# EasyEDA schematic SCH_QR Code Scanning Kiosk PCB V3 MKR_2022-02-02.json
TITLE: QR Code Scanning Kiosk; REV: 3.0; Date: 2021-10-15; Sheet: 1/1; Drawn By: Steve Julian; Company: BizKiwi.NZ
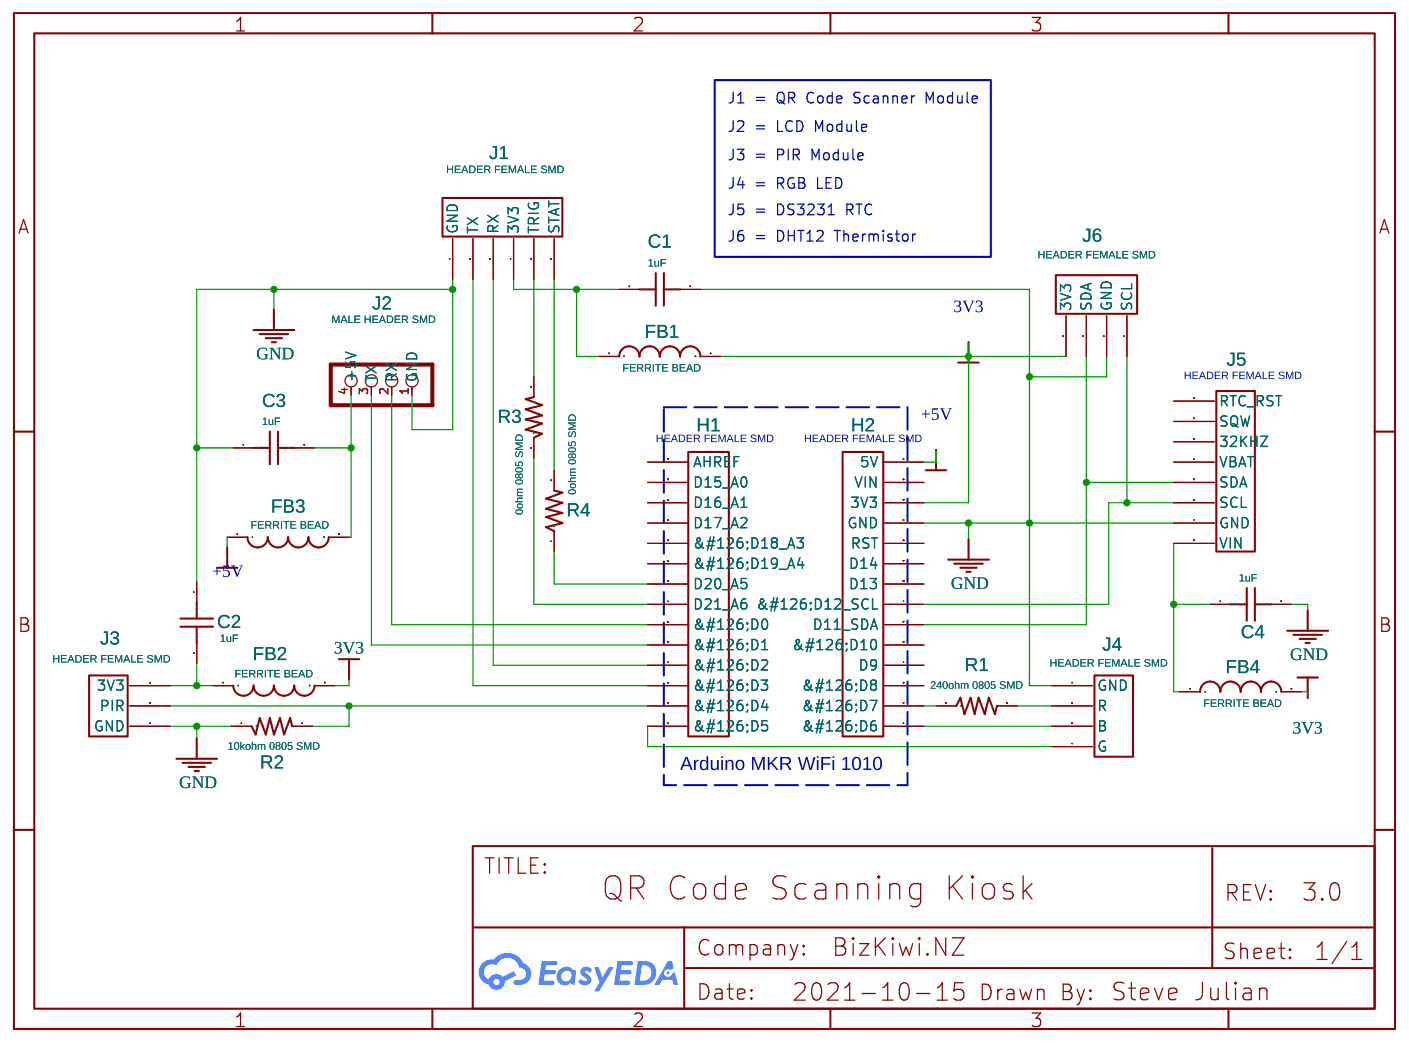
[diagram p0: schematic sheet]

## Parts
C1  1uF  [0805]
C2  1uF  [0805]
C3  1uF  [0805]
C4  1uF  [0805]
FB1  FERRITE BEAD  [0805]
FB2  FERRITE BEAD  [0805]
FB3  FERRITE BEAD  [0805]
FB4  FERRITE BEAD  [0805]
H1  HEADER FEMALE 2.54MM 1X14 SMD TYPES 1 AND 2  [HDR-14X1/2.54 SMD TYPES 1 AND 2]
H2  HEADER FEMALE 2.54MM 1X14 SMD TYPES 1 AND 2  [HDR-14X1/2.54 SMD TYPES 1 AND 2]
J1  HEADER FEMALE SMD  [HDR-6X1/2.54 SMD TYPES 1 AND 2]
J2  MALE HEADER SMD  [M1X4_MALE_RIGHT_ANGLED_SMD]
J3  HEADER FEMALE SMD  [HDR-3X1/2.54 SMD TYPES 1 AND 2]
J4  HEADER FEMALE SMD  [HDR-4X1/2.54 SMD TYPES 1 AND 2]
J5  HEADER FEMALE 2.54MM 1X8 SMD TYPES 1 AND 2  [HDR-8X1/2.54 SMD TYPES 1 AND 2]
J6  HEADER FEMALE SMD  [HDR-4X1/2.54 SMD TYPES 1 AND 2]
R1  240ohm 0805 SMD  [RESISTOR 0805]
R2  10kohm 0805 SMD  [RESISTOR 0805]
R3  0ohm 0805 SMD  [RESISTOR 0805]
R4  0ohm 0805 SMD  [RESISTOR 0805]

## Library data of the parts
C1-C4 = CAPACITOR CERAMIC 0805 100NF: Supplier: LCSC; Supplier Part: C141172; Manufacturer: KEMET; Manufacturer Part: C0805X104K5RACAUTO; Contributor: LCSC
FB1-FB4 = FERRITE-BEADB
H1 H2 = -: Supplier: Digi-Key; Manufacturer: Samtec Inc.; Manufacturer Part: SSM-116-L-SV-BE; Supplier Part: SAM11901-ND; Contributor: steve_3356
J1 = HEADER FEMALE 2.54MM 1X6 SMD TYPES 1 AND 2: Supplier: Digi-Key; Manufacturer: Samtec Inc.; Manufacturer Part: SSM-116-L-SV-BE; Supplier Part: SAM11901-ND; Contributor: steve_3356
J2 = MALE_HEADER_SMD_1X04: Contributor: DangerousPrototype; Package Display: No
J3 = HEADER FEMALE 2.54MM 1X3 SMD TYPES 1 AND 2: Supplier: Digi-Key; Manufacturer: Samtec Inc.; Manufacturer Part: SSM-116-L-SV-BE; Supplier Part: SAM11901-ND; Contributor: steve_3356
J4 J6 = HEADER FEMALE 2.54MM 1X4 SMD TYPES 1 AND 2: Supplier: Digi-Key; Manufacturer: Samtec Inc.; Manufacturer Part: SSM-116-L-SV-BE; Supplier Part: SAM11901-ND; Contributor: steve_3356
J5 = HEADER FEMALE 2.54MM 1X8 SMD TYPES 1 AND 2: Supplier: Digi-Key; Manufacturer: Samtec Inc.; Manufacturer Part: SSM-116-L-SV-BE; Supplier Part: SAM11901-ND; Contributor: steve_3356; Package Display: No
R1-R4 = 120ohm 1/8W 0805 SMD: Contributor: steve_3356; Supplier: Digi-Key; Supplier Part: 311-120CRCT-ND; Manufacturer: Yageo; Manufacturer Part: RC0805FR-07120RL

## Nets
3V3: FB1.2 FB2.2 FB4.2 H2.12(3V3) J6.1(3V3)
+5V: FB3.1 H2.14(5V)
GND: C1.2 C2.1 C3.1 C4.2 H2.11(GND) J1.1(GND) J2.1(GND) J3.1(GND) J4.1(GND) J5.7(GND) J6.3(GND) R2.1
Net-(C1-1): C1.1 FB1.1 J1.4(3V3)
Net-(C2-2): C2.2 FB2.1 J3.3(3V3)
Net-(C3-2): C3.2 FB3.2 J2.4(+5V)
Net-(C4-1): C4.1 FB4.1 J5.8(VIN)
Net-(H1-1): H1.1(&#126;D5) J4.4(G)
Net-(H1-2): H1.2(&#126;D4) J3.2(PIR) R2.2
Net-(H1-3): H1.3(&#126;D3) J1.2(TX)
Net-(H1-4): H1.4(&#126;D2) J1.3(RX)
Net-(H1-5): H1.5(&#126;D1) J2.3(TX)
Net-(H1-6): H1.6(&#126;D0) J2.2(RX)
Net-(H1-7): H1.7(D21 A6) R3.1
Net-(H1-8): H1.8(D20 A5) R4.1
Net-(H2-1): H2.1(&#126;D6) J4.3(B)
Net-(H2-2): H2.2(&#126;D7) R1.1
Net-(H2-6): H2.6(D11 SDA) J5.5(SDA) J6.2(SDA)
Net-(H2-7): H2.7(&#126;D12 SCL) J5.6(SCL) J6.4(SCL)
Net-(J1-5): J1.5(TRIG) R3.2
Net-(J1-6): J1.6(STAT) R4.2
Net-(J4-2): J4.2(R) R1.2

Not connected (* = marked no-connect by the designer): H1 9(&#126;D19 A4) 10(&#126;D18 A3) 11(D17 A2) 12(D16 A1) 13(D15 A0) 14(AHREF); H2 3(&#126;D8) 4(D9) 5(&#126;D10) 8(D13) 9(D14) 10(RST) 13(VIN); J5 1(RTC_RST) 2(SQW) 3(32KHZ) 4(VBAT)

## Notes on the sheet
- J1 = QR Code Scanner Module
- J2 = LCD Module
- J3 = PIR Module
- J4 = RGB LED
- J5 = DS3231 RTC
- J6 = DHT12 Thermistor
- HEADER FEMALE SMD
- HEADER FEMALE SMD
- HEADER FEMALE SMD
- Arduino MKR WiFi 1010
